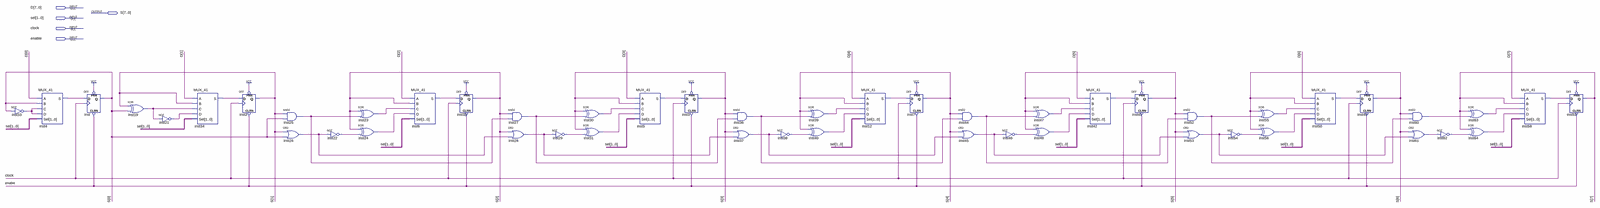
[diagram p0: schematic sheet, whole]
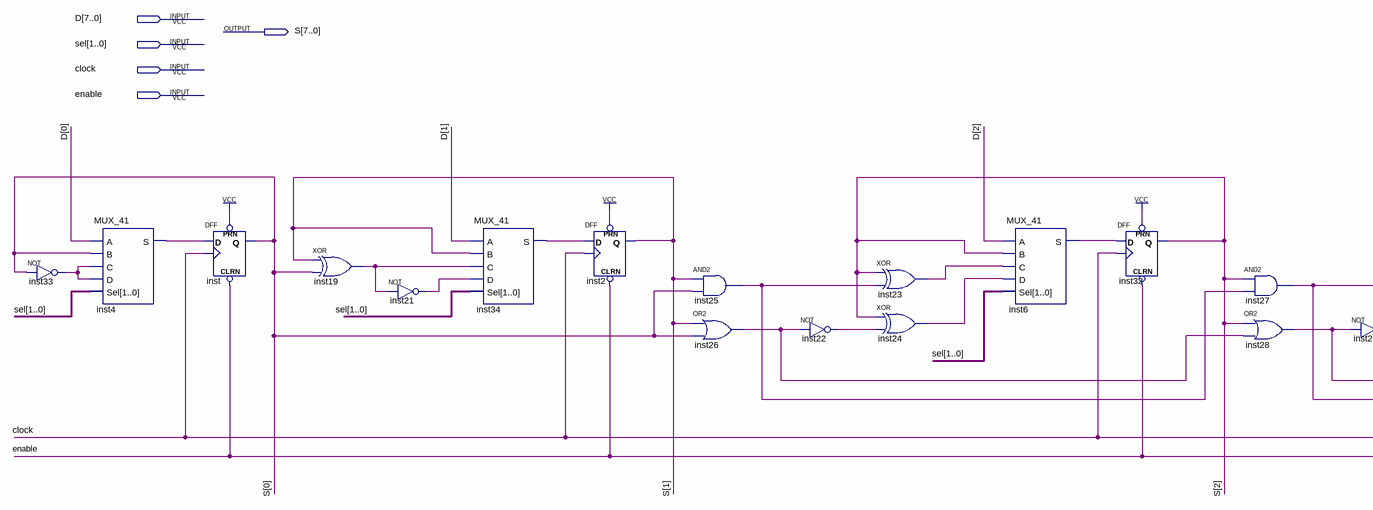
[diagram p1: schematic sheet, left part]
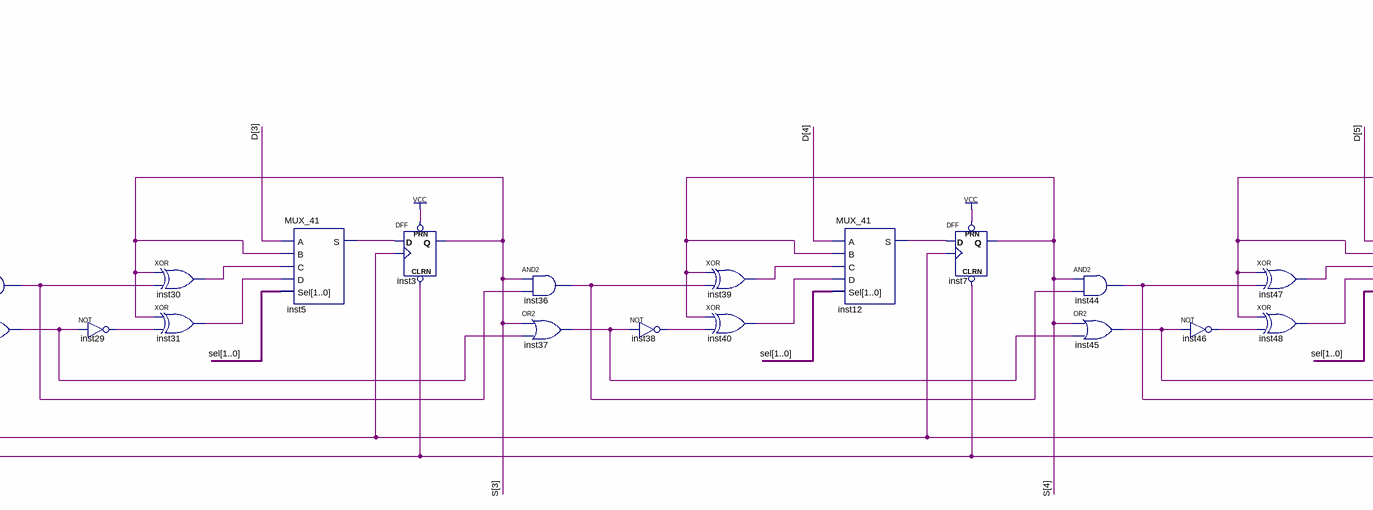
[diagram p2: schematic sheet, centre part]
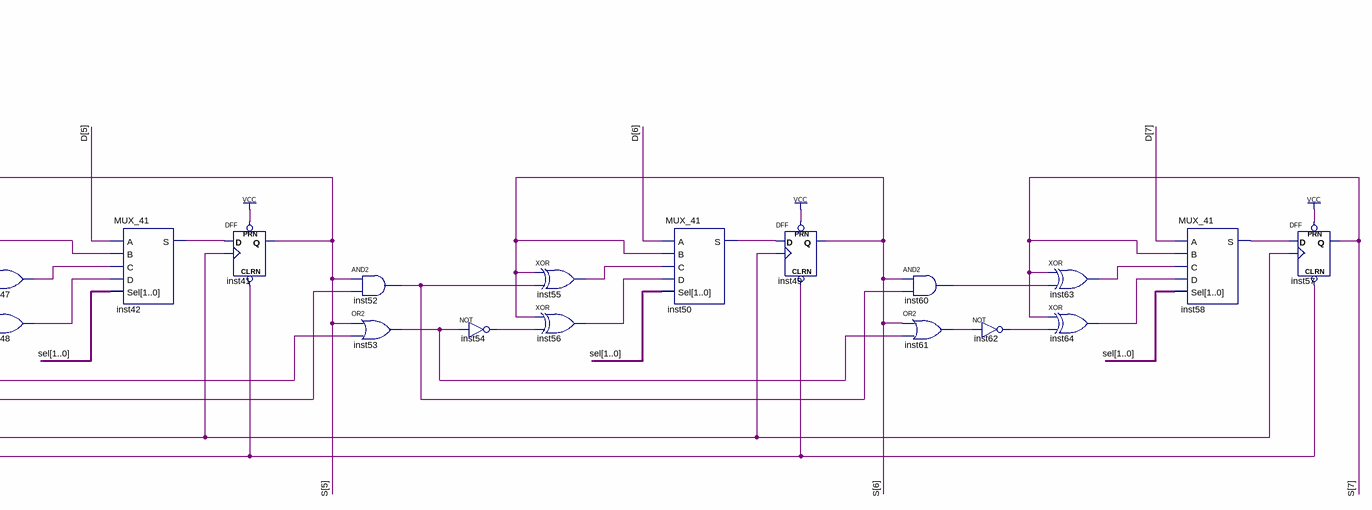
[diagram p3: schematic sheet, right part]
// Quartus schematic SYNC_COUNTER.bdf as structural Verilog: 49 symbols, 5 pins
module SYNC_COUNTER (
  input  [7:0] D,
  input  [1:0] sel,
  input  clock,
  input  enable,
  output [7:0] S
);

  wire inst4_s, inst5_s, inst6_s, inst12_s, inst19_out, inst21_out, inst22_out, inst23_out, inst24_out,
       inst25_out, inst26_out, inst27_out, inst28_out, inst29_out, inst30_out, inst31_out, inst33_out,
       inst34_s, inst36_out, inst37_out, inst38_out, inst39_out, inst40_out, inst42_s, inst44_out,
       inst45_out, inst46_out, inst47_out, inst48_out, inst50_s, inst52_out, inst53_out, inst54_out,
       inst55_out, inst56_out, inst58_s, inst60_out, inst61_out, inst62_out, inst63_out, inst64_out;

  not inst33 (inst33_out, S[0]);
  MUX_41 inst4 (.A(D[0]), .B(S[0]), .C(inst33_out), .D(inst33_out), .Sel(sel), .S(inst4_s));
  DFF inst (.CLRN(enable), .CLK(clock), .D(inst4_s), .PRN(1'b1), .Q(S[0]));
  xor inst19 (inst19_out, S[1], S[0]);
  not inst21 (inst21_out, inst19_out);
  MUX_41 inst34 (.A(D[1]), .B(S[1]), .C(inst19_out), .D(inst21_out), .Sel(sel), .S(inst34_s));
  DFF inst2 (.CLRN(enable), .CLK(clock), .D(inst34_s), .PRN(1'b1), .Q(S[1]));
  and inst25 (inst25_out, S[1], S[0]);
  or inst26 (inst26_out, S[1], S[0]);
  not inst22 (inst22_out, inst26_out);
  xor inst23 (inst23_out, S[2], inst25_out);
  xor inst24 (inst24_out, S[2], inst22_out);
  MUX_41 inst6 (.A(D[2]), .B(S[2]), .C(inst23_out), .D(inst24_out), .Sel(sel), .S(inst6_s));
  DFF inst32 (.CLRN(enable), .CLK(clock), .D(inst6_s), .PRN(1'b1), .Q(S[2]));
  and inst27 (inst27_out, S[2], inst25_out);
  or inst28 (inst28_out, S[2], inst26_out);
  not inst29 (inst29_out, inst28_out);
  xor inst30 (inst30_out, S[3], inst27_out);
  xor inst31 (inst31_out, S[3], inst29_out);
  MUX_41 inst5 (.A(D[3]), .B(S[3]), .C(inst30_out), .D(inst31_out), .Sel(sel), .S(inst5_s));
  DFF inst3 (.CLRN(enable), .CLK(clock), .D(inst5_s), .PRN(1'b1), .Q(S[3]));
  and inst36 (inst36_out, S[3], inst27_out);
  or inst37 (inst37_out, S[3], inst28_out);
  not inst38 (inst38_out, inst37_out);
  xor inst39 (inst39_out, S[4], inst36_out);
  xor inst40 (inst40_out, S[4], inst38_out);
  MUX_41 inst12 (.A(D[4]), .B(S[4]), .C(inst39_out), .D(inst40_out), .Sel(sel), .S(inst12_s));
  DFF inst7 (.CLRN(enable), .CLK(clock), .D(inst12_s), .PRN(1'b1), .Q(S[4]));
  and inst44 (inst44_out, S[4], inst36_out);
  or inst45 (inst45_out, S[4], inst37_out);
  not inst46 (inst46_out, inst45_out);
  xor inst47 (inst47_out, S[5], inst44_out);
  xor inst48 (inst48_out, S[5], inst46_out);
  MUX_41 inst42 (.A(D[5]), .B(S[5]), .C(inst47_out), .D(inst48_out), .Sel(sel), .S(inst42_s));
  DFF inst41 (.CLRN(enable), .CLK(clock), .D(inst42_s), .PRN(1'b1), .Q(S[5]));
  and inst52 (inst52_out, S[5], inst44_out);
  or inst53 (inst53_out, S[5], inst45_out);
  not inst54 (inst54_out, inst53_out);
  xor inst55 (inst55_out, S[6], inst52_out);
  xor inst56 (inst56_out, S[6], inst54_out);
  MUX_41 inst50 (.A(D[6]), .B(S[6]), .C(inst55_out), .D(inst56_out), .Sel(sel), .S(inst50_s));
  DFF inst49 (.CLRN(enable), .CLK(clock), .D(inst50_s), .PRN(1'b1), .Q(S[6]));
  and inst60 (inst60_out, S[6], inst52_out);
  or inst61 (inst61_out, S[6], inst53_out);
  not inst62 (inst62_out, inst61_out);
  xor inst63 (inst63_out, S[7], inst60_out);
  xor inst64 (inst64_out, S[7], inst62_out);
  MUX_41 inst58 (.A(D[7]), .B(S[7]), .C(inst63_out), .D(inst64_out), .Sel(sel), .S(inst58_s));
  DFF inst57 (.CLRN(enable), .CLK(clock), .D(inst58_s), .PRN(1'b1), .Q(S[7]));
endmodule
